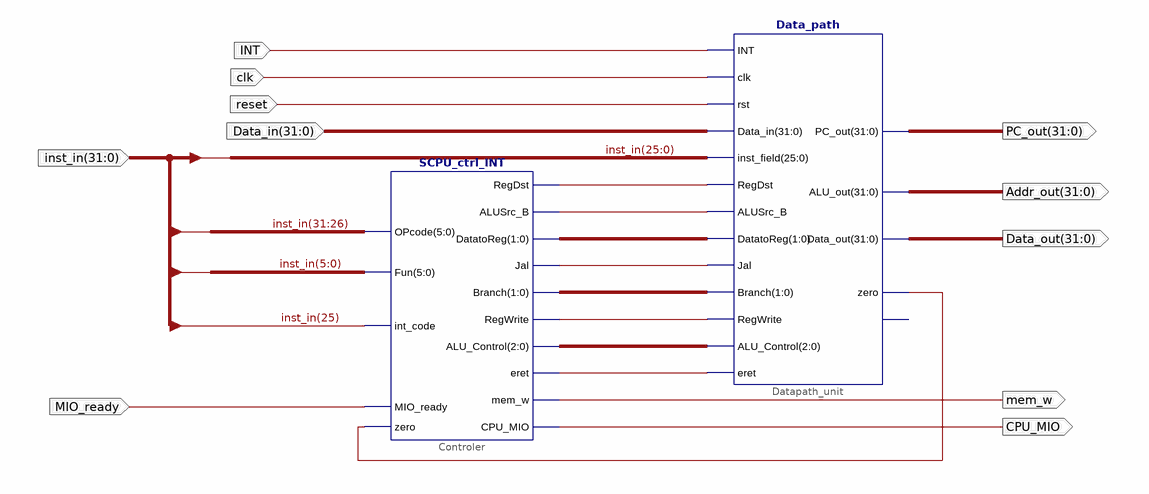
[diagram p0: schematic sheet 1]
// Xilinx ISE schematic SCPU.sch (kintex7) as structural Verilog: 2 symbols, 11 ports
module SCPU (
  input  clk,
  input  reset,
  input  [31:0] Data_in,
  input  [31:0] inst_in,
  input  INT,
  input  MIO_ready,
  output [31:0] PC_out,
  output [31:0] Addr_out,
  output [31:0] Data_out,
  output mem_w,
  output CPU_MIO
);

  wire XLXN_65, XLXN_66, XLXN_68, XLXN_70, XLXN_114, XLXN_119;
  wire [1:0] XLXN_67, XLXN_69;
  wire [2:0] XLXN_71;

  SCPU_ctrl_INT Controler (
    .RegDst(XLXN_65), .ALUSrc_B(XLXN_66), .DatatoReg(XLXN_67), .Jal(XLXN_68), .eret(XLXN_114),
    .RegWrite(XLXN_70), .Branch(XLXN_69), .ALU_Control(XLXN_71), .mem_w(mem_w), .CPU_MIO(CPU_MIO),
    .OPcode(inst_in[31:26]), .Fun(inst_in[5:0]), .int_code(inst_in[25]), .MIO_ready(MIO_ready),
    .zero(XLXN_119));
  Data_path Datapath_unit (
    .eret(XLXN_114), .ALU_Control(XLXN_71), .RegWrite(XLXN_70), .Branch(XLXN_69), .Jal(XLXN_68),
    .DatatoReg(XLXN_67), .inst_field(inst_in[25:0]), .Data_in(Data_in), .rst(reset), .ALUSrc_B(XLXN_66),
    .clk(clk), .RegDst(XLXN_65), .INT(INT), .PC_out(PC_out), .ALU_out(Addr_out), .Data_out(Data_out),
    .zero(XLXN_119));  // open: overflow
endmodule
